# Altium schematic sheet Sheet_Final.SchDoc
size 381 x 241 mm; SheetNumber: 1; SheetTotal: 1
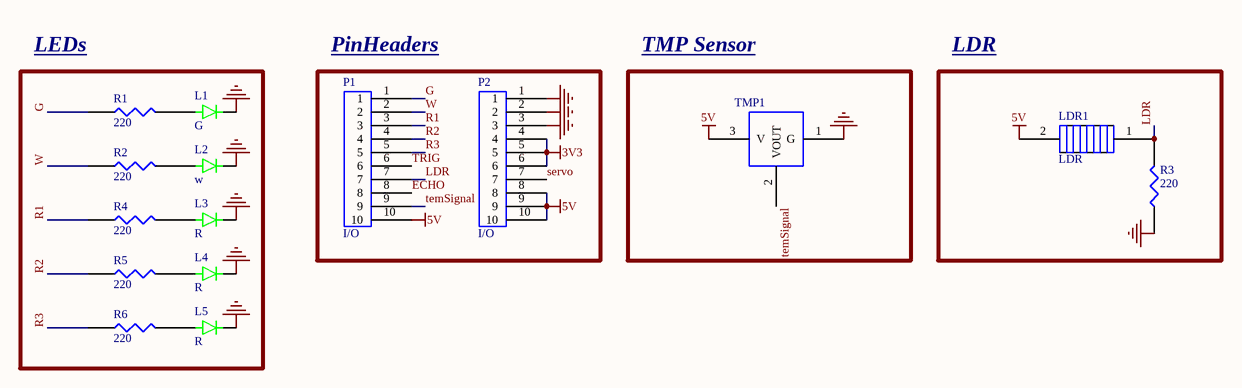
[diagram p0: Sheet_Final.SchDoc]

## Parts
L1  G  [Led]
L2  w  [Led]
L3  R  [Led]
L4  R  [Led]
L5  R  [Led]
LDR1  LDR  [LDR]
P1  I/O  [pin headers]
P2  I/O  [pin headers]
R1  220  [AXIAL0.3]
R2  220  [AXIAL0.3]
R3  220  [AXIAL0.3]
R4  220  [AXIAL0.3]
R5  220  [AXIAL0.3]
R6  220  [AXIAL0.3]
TMP1  LM35DZ  [LM35DZ]  (value not drawn)

## Blocks framed on the sheet
PinHeaders: P1 P2
TMP Sensor: TMP1
LDR: LDR1 R3

## Nets
3V3: P2.4 P2.5 P2.6
5V: LDR1.2 P1.10 P2.8 P2.9 P2.10 TMP1.3(V)
GND: L1.2 L2.2 L3.2 L4.2 L5.2 P2.1 P2.2 P2.3 R3.1 TMP1.1(G)
ECHO: P1.8
G: P1.1 R1.1
LDR: LDR1.1 P1.7 R3.2
R1: P1.3 R4.1
R2: P1.4 R5.1
R3: P1.5 R6.1
servo: P2.7
temSignal: P1.9 TMP1.2(VOUT)
TRIG: P1.6
W: P1.2 R2.1
NetL1_1: L1.1 R1.2
NetL2_1: L2.1 R2.2
NetL3_1: L3.1 R4.2
NetL4_1: L4.1 R5.2
NetL5_1: L5.1 R6.2

## Notes on the sheet
- LEDs

## Library data of the parts
L1-L5 = G_Led: Supplier: Maker
LDR1 = LDR: 540nm 100kΩ~200kΩ 10MΩ Through Hole,P=3mm Photoresistors ROHS; Manufacturer: Senba Sensing Tech; Mfr. Part #: GL5549; Supplier: LCSC; Supplier. part #: C125631; ComponentLink1Description: Datasheet; ComponentLink1URL: https://www.lcsc.com/datasheet/C125631.pdf
P1 P2 = Pin Headers: 250V 3A Through Hole Pin Header 2.5mm 4P 6mm -40℃~+105℃ 3mm 2.54mm 1 Black 1x4P Through Hole,P=2.54mm Pin Headers ROHS; Manufacturer: XFCN; Mfr. Part #: PZ254V-11-04P; Supplier: LCSC; Supplier Part #: C2691448; ComponentLink1Description: Datasheet; ComponentLink1URL: https://www.lcsc.com/datasheet/C2691448.pdf; ComponentLink2Description: Link of component; ComponentLink2URL: https://www.lcsc.com/product-detail/C2691448.html?s_z=n_pin%2520header
R1-R6 = RES1
TMP1 = LM35DZ: ±1.5℃ TO-92 Temperature Sensors ROHS; Manufacturer: TI; Mfr. Part #: LM35DZ/NOPB; Supplier: LCSC; Supplier. part #: C12165; ComponentLink1Description: Datasheet; ComponentLink1URL: https://www.lcsc.com/datasheet/C12165.pdf